# Altium schematic sheet Sch_Dr_Baro.SchDoc
size A4 portrait; Organization: Altium Limited; Address1: L3, 12a Rodborough Rd; Address2: Frenchs Forest; Address3: NSW; Address4: Australia 2086
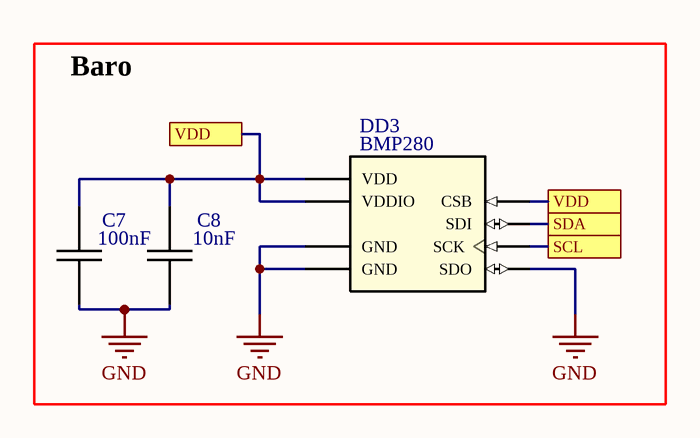
[diagram p0: Sch_Dr_Baro.SchDoc]

## Parts
C7  100nF  [Cap_0603]
C8  10nF  [Cap_0603]
DD3  BMP280  [8-pin metal-lid LGA 2.0*2.5*0.95]

## Blocks framed on the sheet
Baro: C7 C8 DD3

## Ports
SCL, SDA, VDD

## Nets
GND: C7.1 C8.1 DD3.1(GND) DD3.5(SDO) DD3.7(GND)
SCL: DD3.4(SCK) ; port SCL
SDA: DD3.3(SDI) ; port SDA
VDD: C7.2 C8.2 DD3.2(CSB) DD3.6(VDDIO) DD3.8(VDD) ; port VDD

## Notes on the sheet
- Title
- Size:
- Date:
- A4
- Number:
- Time:
- Revision:
- Sheet
- of
- File:

## Library data of the parts
C7 = Cap_: CC0603JRX7R8BB104
C8 = Cap_: CC0603JRNPO9BN103
DD3 = BMP280: BMP280 Absolute Barometric Pressure Sensor for Battery Powered Devices 2 x 2.5mm